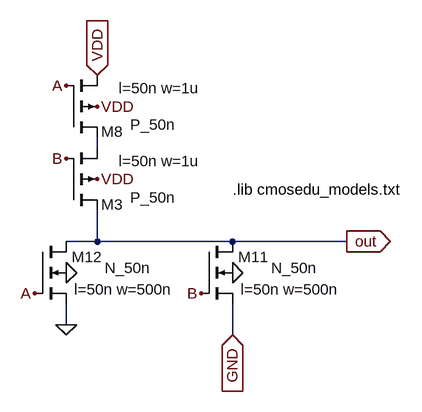
[diagram p0: schematic NOR_2.asc]
NOR_2.asc, the LTspice schematic file:
Version 4
SHEET 1 6288 680
WIRE 864 -128 864 -160
WIRE 912 -400 912 -416
WIRE 912 -256 864 -256
WIRE 912 -256 912 -304
WIRE 1120 -256 912 -256
WIRE 1120 -112 1120 -160
WIRE 1296 -256 1120 -256
FLAG 912 -352 VDD
FLAG 912 -464 VDD
FLAG 1120 -208 0
FLAG 864 -208 0
FLAG 912 -512 VDD
IOPIN 912 -512 In
FLAG 1120 -112 GND
IOPIN 1120 -112 In
FLAG 1296 -256 out
IOPIN 1296 -256 Out
FLAG 864 -496 A
FLAG 816 -176 A
FLAG 864 -384 B
FLAG 1072 -176 B
FLAG 864 -128 0
SYMBOL pmos4 864 -304 M180
WINDOW 0 88 9 Right 0
WINDOW 3 168 20 Right 0
WINDOW 123 206 76 Right 0
SYMATTR InstName M3
SYMATTR Value P_50n
SYMATTR Value2 l=50n w=1u
SYMBOL pmos4 864 -416 M180
WINDOW 0 88 9 Right 0
WINDOW 3 168 20 Right 0
WINDOW 123 206 76 Right 0
SYMATTR InstName M8
SYMATTR Value P_50n
SYMATTR Value2 l=50n w=1u
SYMBOL nmos4 1072 -256 R0
WINDOW 0 104 24 Right 0
WINDOW 3 179 41 Right 0
WINDOW 123 213 74 Right 0
SYMATTR InstName M11
SYMATTR Value N_50n
SYMATTR Value2 l=50n w=500n
SYMBOL nmos4 816 -256 R0
WINDOW 0 104 24 Right 0
WINDOW 3 179 41 Right 0
WINDOW 123 213 74 Right 0
SYMATTR InstName M12
SYMATTR Value N_50n
SYMATTR Value2 l=50n w=500n
TEXT 1120 -336 Left 0 !.lib cmosedu_models.txt

The netlist it stands for:
* NOR_2.asc
M3 out B N001 VDD P_50n l=50n w=1u
M8 N001 A VDD VDD P_50n l=50n w=1u
M11 out B GND 0 N_50n l=50n w=500n
M12 out A 0 0 N_50n l=50n w=500n
.model NMOS NMOS
.model PMOS PMOS
.lib standard.mos
.lib cmosedu_models.txt
.backanno
.end